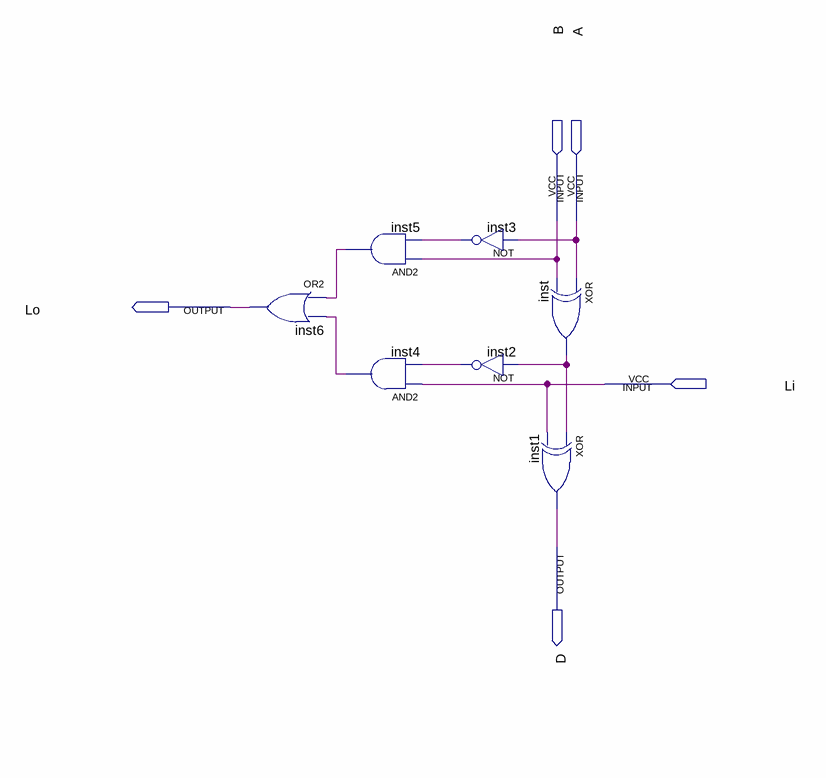
[diagram p0: schematic sheet]
// Quartus schematic 1bit_sub.bdf as structural Verilog: 7 symbols, 5 pins
module \1bit_sub  (
  input  B,
  input  A,
  input  Li,
  output Lo,
  output D
);

  wire inst2_out, inst3_out, inst4_out, inst5_out, inst_out;

  or inst6 (Lo, inst5_out, inst4_out);
  and inst5 (inst5_out, B, inst3_out);
  and inst4 (inst4_out, Li, inst2_out);
  not inst3 (inst3_out, A);
  not inst2 (inst2_out, inst_out);
  xor inst (inst_out, A, B);
  xor inst1 (D, inst_out, Li);
endmodule
